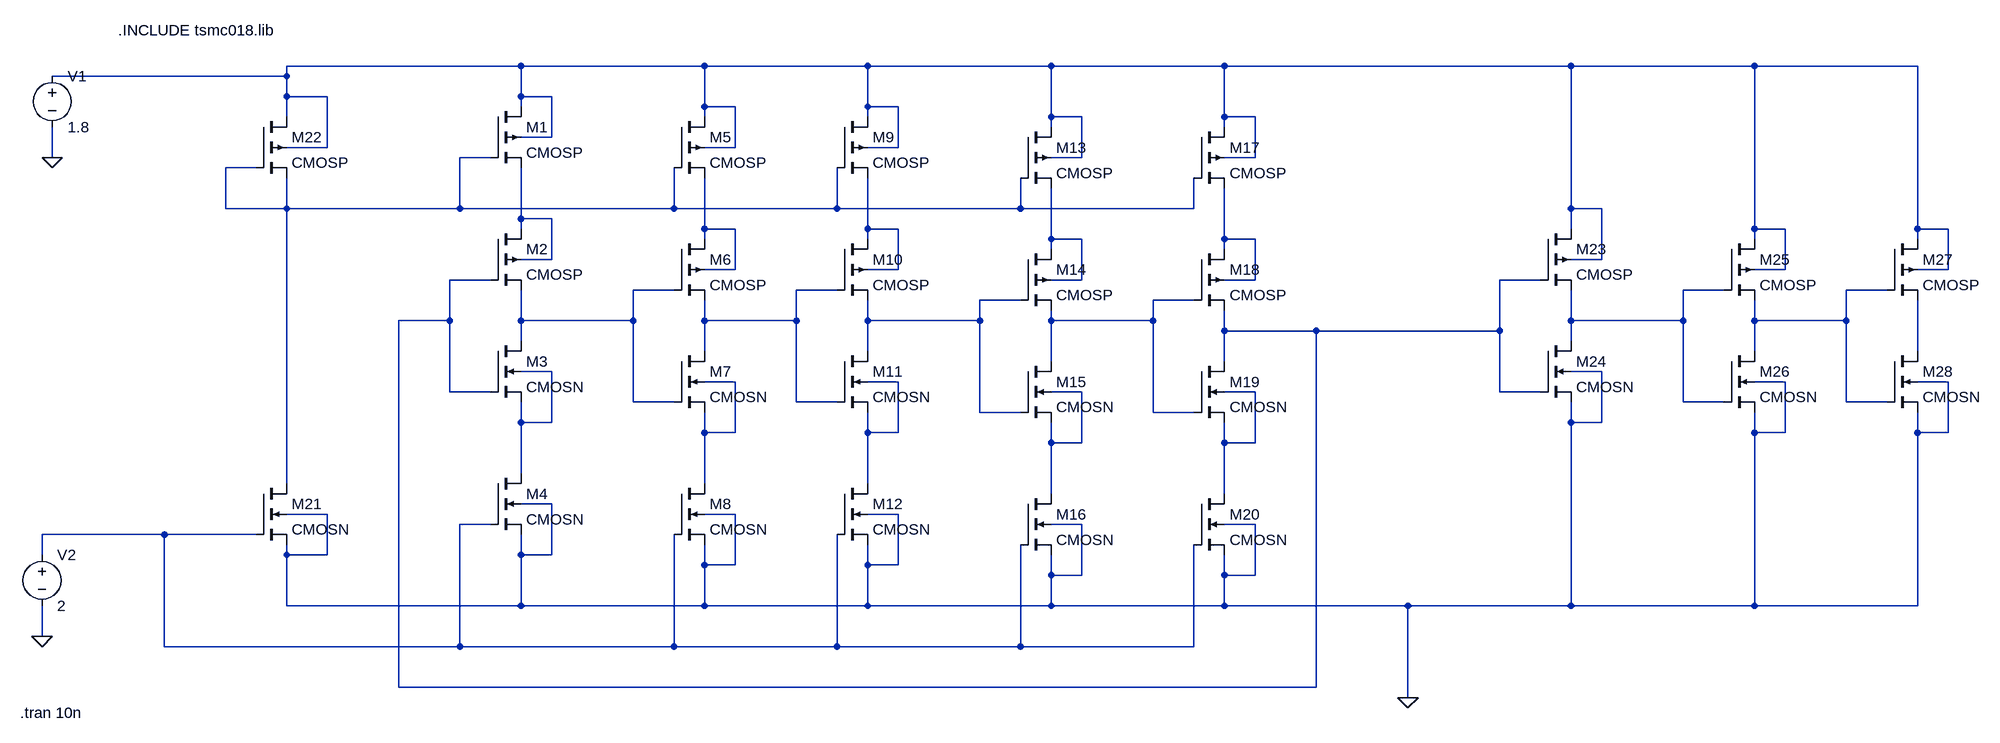
[diagram p0: schematic Circuit_diagram.asc]
Circuit_diagram.asc, the LTspice schematic file:
Version 4
SHEET 1 2516 1016
WIRE 272 -16 -96 -16
WIRE 560 -16 272 -16
WIRE 816 -16 560 -16
WIRE 1104 -16 816 -16
WIRE 1376 -16 1104 -16
WIRE 1920 -16 1376 -16
WIRE 2208 -16 1920 -16
WIRE 2464 -16 2208 -16
WIRE -96 0 -96 -16
WIRE -96 0 -464 0
WIRE -96 32 -96 0
WIRE -32 32 -96 32
WIRE 272 32 272 -16
WIRE 320 32 272 32
WIRE 272 48 272 32
WIRE 560 48 560 -16
WIRE 608 48 560 48
WIRE 816 48 816 -16
WIRE 864 48 816 48
WIRE -96 64 -96 32
WIRE 560 64 560 48
WIRE 816 64 816 48
WIRE 1104 64 1104 -16
WIRE 1152 64 1104 64
WIRE 1376 64 1376 -16
WIRE 1424 64 1376 64
WIRE 1104 80 1104 64
WIRE 1376 80 1376 64
WIRE 320 96 320 32
WIRE 320 96 272 96
WIRE -32 112 -32 32
WIRE -32 112 -96 112
WIRE 608 112 608 48
WIRE 608 112 560 112
WIRE 864 112 864 48
WIRE 864 112 816 112
WIRE -464 128 -464 80
WIRE 224 128 176 128
WIRE 1152 128 1152 64
WIRE 1152 128 1104 128
WIRE 1424 128 1424 64
WIRE 1424 128 1376 128
WIRE -144 144 -192 144
WIRE -192 208 -192 144
WIRE -96 208 -96 160
WIRE -96 208 -192 208
WIRE 176 208 176 128
WIRE 176 208 -96 208
WIRE 512 208 512 144
WIRE 512 208 176 208
WIRE 768 208 768 144
WIRE 768 208 512 208
WIRE 1056 208 1056 160
WIRE 1056 208 768 208
WIRE 1328 208 1328 160
WIRE 1328 208 1056 208
WIRE 1920 208 1920 -16
WIRE 1968 208 1920 208
WIRE 272 224 272 144
WIRE 320 224 272 224
WIRE 272 240 272 224
WIRE 560 240 560 160
WIRE 608 240 560 240
WIRE 816 240 816 160
WIRE 864 240 816 240
WIRE 1920 240 1920 208
WIRE 2208 240 2208 -16
WIRE 2256 240 2208 240
WIRE 2464 240 2464 -16
WIRE 2512 240 2464 240
WIRE 560 256 560 240
WIRE 816 256 816 240
WIRE 1104 256 1104 176
WIRE 1152 256 1104 256
WIRE 1376 256 1376 176
WIRE 1424 256 1376 256
WIRE 2208 256 2208 240
WIRE 2464 256 2464 240
WIRE 1104 272 1104 256
WIRE 1376 272 1376 256
WIRE 320 288 320 224
WIRE 320 288 272 288
WIRE 1968 288 1968 208
WIRE 1968 288 1920 288
WIRE 608 304 608 240
WIRE 608 304 560 304
WIRE 864 304 864 240
WIRE 864 304 816 304
WIRE 2256 304 2256 240
WIRE 2256 304 2208 304
WIRE 2512 304 2512 240
WIRE 2512 304 2464 304
WIRE 224 320 160 320
WIRE 1152 320 1152 256
WIRE 1152 320 1104 320
WIRE 1424 320 1424 256
WIRE 1424 320 1376 320
WIRE 1872 320 1808 320
WIRE 512 336 448 336
WIRE 768 336 704 336
WIRE 2160 336 2096 336
WIRE 2416 336 2352 336
WIRE 1056 352 992 352
WIRE 1328 352 1264 352
WIRE 160 384 160 320
WIRE 160 384 80 384
WIRE 272 384 272 336
WIRE 448 384 448 336
WIRE 448 384 272 384
WIRE 560 384 560 352
WIRE 704 384 704 336
WIRE 704 384 560 384
WIRE 816 384 816 352
WIRE 992 384 992 352
WIRE 992 384 816 384
WIRE 1104 384 1104 368
WIRE 1264 384 1264 352
WIRE 1264 384 1104 384
WIRE 1920 384 1920 336
WIRE 2096 384 2096 336
WIRE 2096 384 1920 384
WIRE 2208 384 2208 352
WIRE 2352 384 2352 336
WIRE 2352 384 2208 384
WIRE 1376 400 1376 368
WIRE 1520 400 1376 400
WIRE 1808 400 1808 320
WIRE 1808 400 1520 400
WIRE 272 416 272 384
WIRE 1920 416 1920 384
WIRE 560 432 560 384
WIRE 816 432 816 384
WIRE 2208 432 2208 384
WIRE 2464 432 2464 352
WIRE 1104 448 1104 384
WIRE 1376 448 1376 400
WIRE 320 464 272 464
WIRE 1968 464 1920 464
WIRE 608 480 560 480
WIRE 864 480 816 480
WIRE 2256 480 2208 480
WIRE 2512 480 2464 480
WIRE 160 496 160 384
WIRE 224 496 160 496
WIRE 1152 496 1104 496
WIRE 1424 496 1376 496
WIRE 1808 496 1808 400
WIRE 1872 496 1808 496
WIRE 448 512 448 384
WIRE 512 512 448 512
WIRE 704 512 704 384
WIRE 768 512 704 512
WIRE 2096 512 2096 384
WIRE 2160 512 2096 512
WIRE 2352 512 2352 384
WIRE 2416 512 2352 512
WIRE 992 528 992 384
WIRE 1056 528 992 528
WIRE 1264 528 1264 384
WIRE 1328 528 1264 528
WIRE 272 544 272 512
WIRE 320 544 320 464
WIRE 320 544 272 544
WIRE 1920 544 1920 512
WIRE 1968 544 1968 464
WIRE 1968 544 1920 544
WIRE 560 560 560 528
WIRE 608 560 608 480
WIRE 608 560 560 560
WIRE 816 560 816 528
WIRE 864 560 864 480
WIRE 864 560 816 560
WIRE 2208 560 2208 528
WIRE 2256 560 2256 480
WIRE 2256 560 2208 560
WIRE 2464 560 2464 528
WIRE 2512 560 2512 480
WIRE 2512 560 2464 560
WIRE 1104 576 1104 544
WIRE 1152 576 1152 496
WIRE 1152 576 1104 576
WIRE 1376 576 1376 544
WIRE 1424 576 1424 496
WIRE 1424 576 1376 576
WIRE 272 624 272 544
WIRE -96 640 -96 208
WIRE 560 640 560 560
WIRE 816 640 816 560
WIRE 1104 656 1104 576
WIRE 1376 656 1376 576
WIRE 320 672 272 672
WIRE -32 688 -96 688
WIRE 608 688 560 688
WIRE 864 688 816 688
WIRE 224 704 176 704
WIRE 1152 704 1104 704
WIRE 1424 704 1376 704
WIRE -288 720 -480 720
WIRE -144 720 -288 720
WIRE -480 752 -480 720
WIRE -96 752 -96 736
WIRE -32 752 -32 688
WIRE -32 752 -96 752
WIRE 272 752 272 720
WIRE 320 752 320 672
WIRE 320 752 272 752
WIRE 560 768 560 736
WIRE 608 768 608 688
WIRE 608 768 560 768
WIRE 816 768 816 736
WIRE 864 768 864 688
WIRE 864 768 816 768
WIRE 1104 784 1104 752
WIRE 1152 784 1152 704
WIRE 1152 784 1104 784
WIRE 1376 784 1376 752
WIRE 1424 784 1424 704
WIRE 1424 784 1376 784
WIRE -96 832 -96 752
WIRE 272 832 272 752
WIRE 272 832 -96 832
WIRE 560 832 560 768
WIRE 560 832 272 832
WIRE 816 832 816 768
WIRE 816 832 560 832
WIRE 1104 832 1104 784
WIRE 1104 832 816 832
WIRE 1376 832 1376 784
WIRE 1376 832 1104 832
WIRE 1664 832 1376 832
WIRE 1920 832 1920 544
WIRE 1920 832 1664 832
WIRE 2208 832 2208 560
WIRE 2208 832 1920 832
WIRE 2464 832 2464 560
WIRE 2464 832 2208 832
WIRE -480 880 -480 832
WIRE -288 896 -288 720
WIRE 176 896 176 704
WIRE 176 896 -288 896
WIRE 512 896 512 720
WIRE 512 896 176 896
WIRE 768 896 768 720
WIRE 768 896 512 896
WIRE 1056 896 1056 736
WIRE 1056 896 768 896
WIRE 1328 896 1328 736
WIRE 1328 896 1056 896
WIRE 80 960 80 384
WIRE 1520 960 1520 400
WIRE 1520 960 80 960
WIRE 1664 976 1664 832
FLAG -464 128 0
FLAG -480 880 0
FLAG 1664 976 0
DATAFLAG 176 784 ""
SYMBOL cmosp 224 48 R0
SYMATTR InstName M1
SYMATTR Value2 l=180n w=1u
SYMBOL cmosp 224 240 R0
SYMATTR InstName M2
SYMATTR Value2 l=180n w=1u
SYMBOL cmosn 224 416 R0
SYMATTR InstName M3
SYMATTR Value2 l=180n w=1u
SYMBOL cmosn 224 624 R0
SYMATTR InstName M4
SYMATTR Value2 l=180n w=1u
SYMBOL cmosp 512 64 R0
SYMATTR InstName M5
SYMATTR Value2 l=180n w=1u
SYMBOL cmosp 512 256 R0
SYMATTR InstName M6
SYMATTR Value2 l=180n w=1u
SYMBOL cmosn 512 432 R0
SYMATTR InstName M7
SYMATTR Value2 l=180n w=1u
SYMBOL cmosn 512 640 R0
SYMATTR InstName M8
SYMATTR Value2 l=180n w=1u
SYMBOL cmosp 768 64 R0
SYMATTR InstName M9
SYMATTR Value2 l=180n w=1u
SYMBOL cmosp 768 256 R0
SYMATTR InstName M10
SYMATTR Value2 l=180n w=1u
SYMBOL cmosn 768 432 R0
SYMATTR InstName M11
SYMATTR Value2 l=180n w=1u
SYMBOL cmosn 768 640 R0
SYMATTR InstName M12
SYMATTR Value2 l=180n w=1u
SYMBOL cmosp 1056 80 R0
SYMATTR InstName M13
SYMATTR Value2 l=180n w=1u
SYMBOL cmosp 1056 272 R0
SYMATTR InstName M14
SYMATTR Value2 l=180n w=1u
SYMBOL cmosn 1056 448 R0
SYMATTR InstName M15
SYMATTR Value2 l=180n w=1u
SYMBOL cmosn 1056 656 R0
SYMATTR InstName M16
SYMATTR Value2 l=180n w=1u
SYMBOL cmosp 1328 80 R0
SYMATTR InstName M17
SYMATTR Value2 l=180n w=1u
SYMBOL cmosp 1328 272 R0
SYMATTR InstName M18
SYMATTR Value2 l=180n w=1u
SYMBOL cmosn 1328 448 R0
SYMATTR InstName M19
SYMATTR Value2 l=180n w=1u
SYMBOL cmosn 1328 656 R0
SYMATTR InstName M20
SYMATTR Value2 l=180n w=1u
SYMBOL cmosn -144 640 R0
SYMATTR InstName M21
SYMATTR Value2 l=180n w=1u
SYMBOL cmosp -144 64 R0
SYMATTR InstName M22
SYMATTR Value2 l=180n w=1u
SYMBOL voltage -464 -16 R0
WINDOW 123 0 0 Left 0
WINDOW 39 0 0 Left 0
SYMATTR InstName V1
SYMATTR Value 1.8
SYMBOL voltage -480 736 R0
WINDOW 123 0 0 Left 0
WINDOW 39 0 0 Left 0
SYMATTR InstName V2
SYMATTR Value 2
SYMBOL cmosp 1872 240 R0
SYMATTR InstName M23
SYMATTR Value2 l=180n w=1u
SYMBOL cmosn 1872 416 R0
SYMATTR InstName M24
SYMATTR Value2 l=180n w=1u
SYMBOL cmosp 2160 256 R0
SYMATTR InstName M25
SYMATTR Value2 l=180n w=1u
SYMBOL cmosn 2160 432 R0
SYMATTR InstName M26
SYMATTR Value2 l=180n w=1u
SYMBOL cmosp 2416 256 R0
SYMATTR InstName M27
SYMATTR Value2 l=180n w=1u
SYMBOL cmosn 2416 432 R0
SYMATTR InstName M28
SYMATTR Value2 l=180n w=1u
TEXT -360 -72 Left 2 !.INCLUDE tsmc018.lib
TEXT -514 1000 Left 2 !.tran 10n

The netlist it stands for:
* Circuit_diagram.asc
M1 N001 N002 N003 N001 CMOSP l=180n w=1u
M2 N003 N008 N009 N003 CMOSP l=180n w=1u
M3 N009 N008 N016 N016 CMOSN l=180n w=1u
M4 N016 N021 0 0 CMOSN l=180n w=1u
M5 N001 N002 N004 N001 CMOSP l=180n w=1u
M6 N004 N009 N010 N004 CMOSP l=180n w=1u
M7 N010 N009 N017 N017 CMOSN l=180n w=1u
M8 N017 N021 0 0 CMOSN l=180n w=1u
M9 N001 N002 N005 N001 CMOSP l=180n w=1u
M10 N005 N010 N013 N005 CMOSP l=180n w=1u
M11 N013 N010 N018 N018 CMOSN l=180n w=1u
M12 N018 N021 0 0 CMOSN l=180n w=1u
M13 N001 N002 N006 N001 CMOSP l=180n w=1u
M14 N006 N013 N014 N006 CMOSP l=180n w=1u
M15 N014 N013 N019 N019 CMOSN l=180n w=1u
M16 N019 N021 0 0 CMOSN l=180n w=1u
M17 N001 N002 N007 N001 CMOSP l=180n w=1u
M18 N007 N014 N008 N007 CMOSP l=180n w=1u
M19 N008 N014 N020 N020 CMOSN l=180n w=1u
M20 N020 N021 0 0 CMOSN l=180n w=1u
M21 N002 N021 0 0 CMOSN l=180n w=1u
M22 N001 N002 N002 N001 CMOSP l=180n w=1u
V1 N001 0 1.8
V2 N021 0 2
M23 N001 N008 N011 N001 CMOSP l=180n w=1u
M24 N011 N008 0 0 CMOSN l=180n w=1u
M25 N001 N011 N012 N001 CMOSP l=180n w=1u
M26 N012 N011 0 0 CMOSN l=180n w=1u
M27 N001 N012 N015 N001 CMOSP l=180n w=1u
M28 N015 N012 0 0 CMOSN l=180n w=1u
.model NMOS NMOS
.model PMOS PMOS
.lib standard.mos
.INCLUDE tsmc018.lib
.tran 10n
.backanno
.end